# Altium schematic sheet CircuitDesign.SchDoc
size A; SheetNumber: 1; SheetTotal: 1
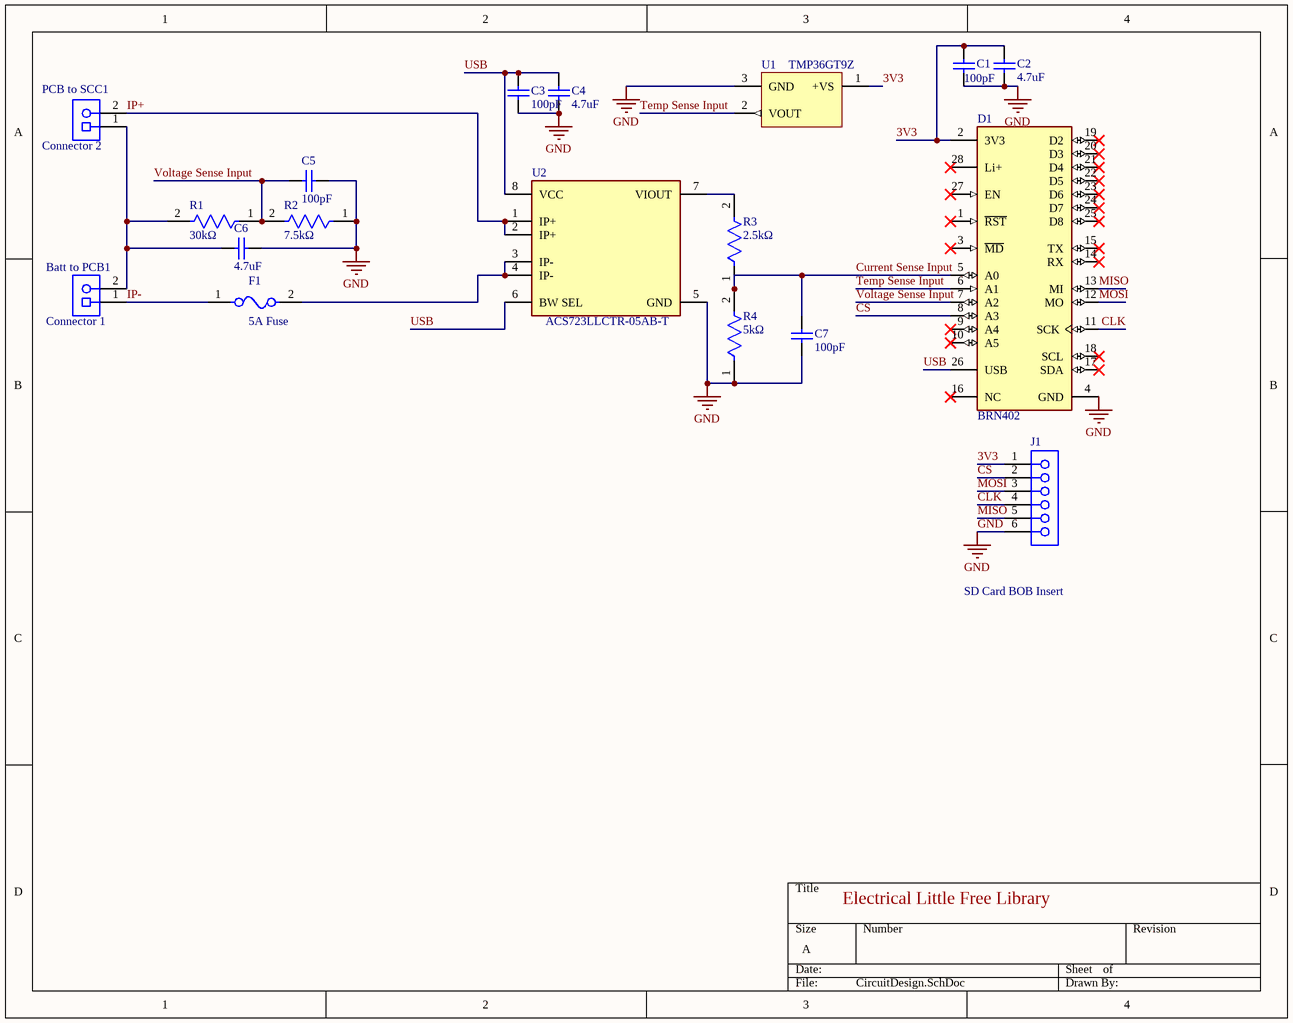
[diagram p0: CircuitDesign.SchDoc]

## Parts
Batt_to_PCB1  Connector 1  [PHOE-1729128-2_V]
C1  100pF  [CAPC1608X90X40ML10T20]
C2  4.7uF  [CAPC2013X135X45LL10T25]
C3  100pF  [CAPC1608X90X40ML10T20]
C4  4.7uF  [CAPC2013X135X45LL10T25]
C5  100pF  [CAPC1608X90X40ML10T20]
C6  4.7uF  [CAPC2013X135X45LL10T25]
C7  100pF  [CAPC1608X90X40ML10T20]
D1  BRN402  [FP-BRN402-0]
F1  5A Fuse  [FP-3568-MFG]
J1  SD Card BOB Insert  [61300611821]
PCB_to_SCC1  Connector 2  [PHOE-1729128-2_V]
R1  30kΩ  [FP-CRCW0805-e3-MFG]
R2  7.5kΩ  [FP-CR0805-IPC_B]
R3  2.5kΩ  [FP-RN732A-IPC_B]
R4  5kΩ  [FP-RC0402-MFG]
U1  TMP36GT9Z  [ADI-T-3]
U2  ACS723LLCTR-05AB-T  [FP-LC-8-MFG]

## Nets
GND: C1.2 C2.1 C3.2 C4.1 C5.2 C6.1 C7.2 D1.4(GND) J1.6 R2.1 R4.1 U1.3(GND) U2.5(GND)
3V3: C1.1 C2.2 D1.2(3V3) J1.1 U1.1(+VS)
CLK: D1.11(SCK) J1.4
CS: D1.8(A3) J1.2
Current Sense Input: C7.1 D1.5(A0) R3.1 R4.2
IP+: PCB_to_SCC1.2 U2.1(IP+) U2.2(IP+)
IP-: Batt_to_PCB1.1 F1.1
MISO: D1.13(MI) J1.5
MOSI: D1.12(MO) J1.3
Temp Sense Input: D1.6(A1) U1.2(VOUT)
USB: C3.1 C4.2 D1.26(USB) U2.6(BW_SEL) U2.8(VCC)
Voltage Sense Input: C5.1 D1.7(A2) R1.1 R2.2
NetBatt_to_PCB1_2: Batt_to_PCB1.2 C6.2 PCB_to_SCC1.1 R1.2
NetF1_2: F1.2 U2.3(IP-) U2.4(IP-)
NetR3_2: R3.2 U2.7(VIOUT)

Not connected (* = marked no-connect by the designer): D1 1(~{RST})* 3(~{MD})* 9(A4)* 10(A5)* 14(RX)* 15(TX)* 16(NC)* 17(SDA)* 18(SCL)* 19(D2)* 20(D3)* 21(D4)* 22(D5)* 23(D6)* 24(D7)* 25(D8)* 27(EN)* 28(Li+)*

## Notes on the sheet
- Electrical Little Free Library

## Library data of the parts
Batt_to_PCB1 PCB_to_SCC1 = CMP-2000-05815-1: PCB Terminal Block, 13.5 A, 400 V, 2-Pin THD, RoHS, Bulk; PartNumber: 1729128; Manufacturer: Phoenix Contact; Package Version: 03/2015; No. of Rows: 1; Pitch: 5.08mm; No. of Positions: 2; Voltage Rating: 400V; Current Rating: 13500mA; Manufacturer URL: http://www.phoenixcontact.com/; Datasheet URL: https://datasheet.ciiva.com/16046/1729128-16046181.pdf; RoHS: TRUE; Package URL: https://www.phoenixcontact.com/online/portal/pi/pxc/product_detail_page/!ut/p/b1/3VdJjqNKFDxLH8AFycySyWY2ozFsEPOMMQaDOX1XedGL_1Vdm5YXJleknhSKeBkvI6EA8ncAo3AYoDhBQGco6KN7VURTdemj9us_IEKEZo_YHiPAEWEFmDGOHMORkqKYCORBZxgL7ZoaZYcbFFUZ3fqxSY6GOuxydWUuHqz1ynmMFygu583Bob0Ewr6Sd_l-5m-kAueHiB0jpRwZwe58wwtkpxtMYd_LmGcDRU02dRNEyWt6Y2ti5pSyJ_reIkzIulrqApdnbT11V5jnCKbYNCvhEM1MCpPByat_X379-iThf08CI5GfOPqfBeS3BRoBOdD55AKVv0iLwCMq-2BrzXWSGRH7pUGD9uwXQjiph3xL0DKQwdGa0JImiIOmBNOestqgwTHSSs2oOep-78apyXQBvNi8ZLaFjvjWvcaUEBu0MC6Wbe-d6mB0FAebo2lUWinqYaZs5DAYzV0RP9yitUjnGJ0iI9xhZkT42OCQNUJJhkgWINNQLP2JFP6OpMg3JCVg70jqHT0lvKOnhHf0lPuOnnLf0VPuWx6_dxwUIvwk5WMkT0kLL1mh61l2yZVSzG3pYV_bqo-mj6uMKwKwdnnW8Jh5RTOJzMOA5c-eJDaZQw4mTMPH02PvS_ZAqNVjVTo2WyYLkwH_KU1mmmG5kjRhDqPXLwwVHvVOjCM60-fpXvTDfMGW1PVFVS1r4e4yVDk4ZdNbkUHvqPqQSeian4UD39fNKmachqdJ1NJbyk8rXT9mXTvPk3oE5meulKGgiruPJek-4I9hTT6G8ZLOyRSm2RRVbThERQad5OS28hdt4YW4vG0stgYYzsWsK4_7y6DZMjJSCqri1kyiZR5vD7pwIrNR7QwPHTcLTI5qT7eRlpHrdGiupYlqQDJ7zy_CND8fWWBoLRXxk1RVcXiBQwbTD4Xi7KL-FuO94t9xaqweXzH; Package Description: 2-Pin Through Hole Device, Body 8.1 x 10.16 mm, Pitch 5.08 mm; Datasheet Version: 12/2013; Mounting Technology: ThroughHole; Orientation: Horizontal; Package Reference: 1729128-2; Packing: Bulk
C1 C3 C5 C7 = CMP-2100-03594-1: Chip Capacitor, 100 pF, +/- 5%, 50 V, -55 to 125 degC, 0603 (1608 Metric), RoHS, Tape and Reel; Manufacturer: Yageo; Voltage Rating (DC): 50V; Dielectric: C0G; Temperature Coefficient: 30ppm/degC; Insulation Resistance: 100GR; Datasheet Version: Rev. 14, 07/2016; Manufacturer URL: http://www.yageo.com/; Packaging: TapeandReel; Mount: SurfaceMount; RoHSCompliant: True; Package Reference: 0603; Tolerance: 5%; Max Operating Temperature: 125degC; Case Code (Imperial): 0603; Capacitance: 100pF; Number of Pins: 2; Width: 0.8mm; Case Code (Metric): 1608; Voltage: 50V; REACH SVHC: Unknown; Package Description: 2-Pin Surface Mount Device, Body 1.6 x 0.8 mm; Composition: Ceramic; Lead Free: LeadFree; Min Operating Temperature: -55degC; Radiation Hardening: No; Depth: 0.8mm; Thickness: 0.035inch; Datasheet URL: http://www.yageo.com/documents/recent/UPY-GP_NP0_16V-to-50V_14.pdf; Termination: SMD/SMT; Package Quantity: 1; Length: 1.6mm; Voltage Rating: 50V; Height: 0.8mm; Case/Package: 0603
C2 C4 C6 = CMP-1662-00015-2: Chip Capacitor, 4.7 uF, +/- 10%, 16 V, -55 to 85 degC, 0805 (2012 Metric), RoHS, Tape and Reel; PartNumber: GRM21BR61C475KA88L; Voltage Rating (DC): 16 V; Type (Capacitors): X5R; Case\/Package: 0805; Pins: 2; DatasheetVersion: 03/2016; REACH SVHC: No SVHC; Tolerance: 10%; Width: 1.25 mm; Capacitance: 4.7 uF; Mount: Surface Mount; ComponentLink1Description: Manufacturer URL; Case Code (Metric): 2012; PackageDescription: 2-Pin Surface Mount Device, Body 2 x 1.25 mm; Height: 1.25 mm; Voltage Rating: 16 V; Max Operating Temperature: 85 degC; RoHSCompliant: true; Length: 2 mm; ComponentLink1URL: http://www.murata.com/; Mounting Technology: Surface Mount; Packaging: Tape and Reel; Min Operating Temperature: -55 degC; ComponentLink2Description: Datasheet; Case Code (Imperial): 0805; Radiation Hardening: No; Package Quantity: 3000; PackageReference: 0805; ComponentLink2URL: http://search.murata.co.jp/Ceramy/image/img/A01X/G101/ENG/GRM21BR61C475KA88-01.pdf
D1 = CMP-201502-000001-1: BORON LTE; Manufacturer: Particle; Number Of Adc Channels: 6; Data Rate: 2000kbits/s; Max Frequency: 3000MHz; Min Supply Voltage: 3V; Interface: I2C,SPI,UART,USB; Max Supply Voltage: 4.4V; Bandwidth: 2302MHz; Nominal Supply Current: 70-100000uA; Number Of Gpio: 20; Category: UNK; Temperature Range Low: -20°C; Temperature: -20°C to +60°C; Package: BRN402; Automotive: No; Device Class L2: RF Semiconductors and Devices; ComponentLink2Description: Datasheet; Manufacturer Part Number: BRN402; ComponentLink2URL: https://docs.particle.io/assets/pdfs/datasheets/boron-datasheet.pdf; Lead Free: Yes; Device Class L3: Transceivers; RoHS: TRUE; Octopart: https://octopart.com/brn402-particle-96116406; Device Class L1: Integrated Circuits (ICs); Digikey Description: BORON LTE; Temperature Range High: +60°C
F1 = CMP-2000-05464-2: NexarPartId: 8116161; Approvals: UL; Body Material: Nylon; Illumination Type: Illuminated; Voltage Rating (AC): 500V; Current Rating: 20A; Number of Poles: 1; Color: Black; Material: Brass, Nylon, Tin; Depth: 6.73mm; Max Operating Temperature: 145°C; Length: 16mm; Mount: PCB, Vertical; REACH SVHC: No SVHC; Lead Free: Lead Free; Min Operating Temperature: -50°C; Flammability Rating: UL94 V-0; RoHS: Compliant; Orientation: Vertical; Fuse Current: 20A; Termination: PC Pin; Number of Circuits: 1; Contact Plating: Tin; Voltage: 500V; Contact Material: Brass
J1 = CMP-1502-01322-3: NexarPartId: 21642411; Current Rating: 3A; Operating Supply Voltage: 250V; Contact Resistance: 20mΩ; Gender: Female; Number of Pins: 6; Orientation: Vertical; Lead Pitch: 2.54mm; RoHS: Compliant
R1 = CMP-2001-03804-2: RES Thick Film, 30kΩ, 1%, 0.125W, 100ppm/°C, 0805; Max Power Dissipation: 125mW; Voltage Rating (DC): 150V; Resistance: 30kR; Contact Plating: Tin; Weight: 0.000194oz; Temperature Coefficient: 100ppm/°C; Packaging: Tape and Reel; Height: 0.45mm; Case Code (Imperial): 0805; Max Operating Temperature: 155°C; Case/Package: 0805; Package Quantity: 10; Case Code (Metric): 2012; Features: Automotive AEC-Q200; Mount: Surface Mount; Length: 2mm; Termination: SMD/SMT; Lead Free: Lead Free; Width: 0.049inch; Number of Pins: 2; Depth: 1.25mm; Min Operating Temperature: -55°C; Power Rating: 125mW; Voltage Rating: 150V; Military Standard: Not; Composition: Thick Film; Tolerance: 1%; Number of Terminations: 2; Radiation Hardening: No
R2 = CMP-1013-00609-2: Thick Film Chip Resistors 0805 7.5kΩ 0.125W 1% 100ppm/°C; Max Power Dissipation: 125mW; Voltage Rating: 150V; Resistance: 7.5kR; Features: Moisture Resistant; Height: 0.024inch; Mount: Surface Mount; Case/Package: 0805; Case Code (Metric): 2012; Max Operating Temperature: 155°C; Number of Terminations: 2; Packaging: Tape and Reel; Contact Plating: Tin; Case Code (Imperial): 0805; Width: 0.049inch; Radiation Hardening: No; Thickness: 508um; Termination: SMD/SMT; Min Operating Temperature: -55°C; Tolerance: 1%; Power Rating: 125mW; Package Quantity: 5000; Composition: Thick Film; Length: 2mm; Temperature Coefficient: 100ppm/°C; Depth: 1.25mm; Military Standard: Not
R3 = CMP-04015-065178-1: 2.5kΩ ±0.1% 0.1W, 1/10W Chip Resistor 0805 (2012 Metric) Moisture Resistant Thin Film; Resistance: 2.5kR; Power Rating: 100mW; Voltage Rating: 100V; Temperature Coefficient: 25ppm/°C; Case Code (Metric): 2012; Packaging: Tape and Reel; Case/Package: 0805; Case Code (Imperial): 0805; Tolerance: 0.1%; Termination: SMD/SMT; Min Operating Temperature: -55°C; Max Operating Temperature: 125°C
R4 = CMP-03412-013078-1: RES SMD 5K OHM 1% 1/16W 0402; Manufacturer: Yageo; Manufacturer Part Number: RC0402FR-075KL; Temperature Coefficient: 100ppm/°C; Power Rating: 0.0625W; Voltage Rating: 50V; Temperature Range Low: -55°C; Lead Free: Yes; RoHS: TRUE; Device Class L2: Resistors; Package: RC0402; Footprint Url: https://pccomponents.com/datasheets/YAGEO-20RESISTORS.PDF; Resistance: 5kΩ; Height: 0.4mm; ComponentLink2URL: http://www.yageo.com/documents/recent/PYu-RC_Group_51_RoHS_L_10.pdf; Temperature: -55°C to +155°C; Composition: Thick Film; Device Class L1: Passive Components; Series: RC_L; Ipc Land Pattern Name: RESC10050X35; Tolerance: 1%; Device Class L3: Chip SMD Resistors; Temperature Range High: +155°C; Category: Res; Value: 5kΩ; Automotive: No; Octopart: https://octopart.com/rc0402fr-075kl-yageo-25450038; Digikey Description: RES SMD 5K OHM 1% 1/16W 0402; ComponentLink2Description: Datasheet
U1 = CMP-0887-00067-1: Low Voltage Temperature Sensor, 2.7 to 5.5 V Supply, Industrial, 3-pin TO92 (T-3), Tray; Manufacturer: Analog Devices; ComponentLink2Description: Datasheet; PackageReference: T-3; Packing: Tray; ComponentLink2URL: http://www.analog.com/static/imported-files/data_sheets/TMP35_36_37.pdf; ComponentLink4Description: Product URL; ComponentLink3Description: Package Specification; Code_JEDEC: TO-226-AA; PartNumber: TMP36GT9Z; PackageDescription: 3-Pin Plastic Header-Style Package, 1.27 mm Pitch; PackageVersion: 042208-A, 04/2008; ComponentLink3URL: http://www.analog.com/static/imported-files/packages/PKG_PDF/TO-92(T)/T_3.pdf; ComponentLink1Description: Manufacturer URL; Supply Voltage Range: 2.7 to 5.5 V; Mounting Technology: Through Hole; DatasheetVersion: Rev. F; ComponentLink4URL: http://www.analog.com/en/mems-sensors/digital-temperature-sensors/tmp36/products/product.html; ComponentLink1URL: http://www.analog.com/en/index.html
U2 = CMP-82923-000114-1: SENSOR CURRENT HALL 5A AC/DC; Linearity: 1%; Accuracy: 3%; Number of Channels: 1; Polarity: Bidirectional; Max Supply Current: 14mA; Sensitivity: 400mV/A; Frequency: 80kHz; Response Time: 5us; Max Operating Temperature: 150°C; Case/Package: SOIC; RoHS Compliant: Yes; Current Sensing: 5A; Mount: Surface Mount; Packaging: Tape and Reel; Number of Pins: 8; Min Operating Temperature: -40°C